# Altium schematic sheet 2015-02-06_16-54-561.schdoc
size 214 x 111 mm; SheetNumber: 1; SheetTotal: 1
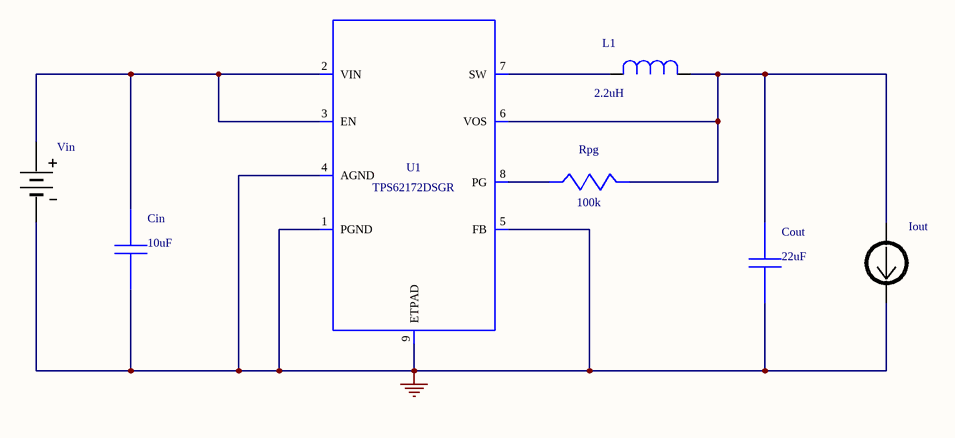
[diagram p0: 2015-02-06_16-54-561.schdoc]

## Parts
Cin  value 10uF  (hidden comment: GRM219R61E106KA12)
Cout  value 22uF  (hidden comment: GRM31CR70J226KE19L)
Iout  WB_CURRENT_LOAD  (value not drawn)
L1  value 2.2uH  (hidden comment: 'VLF252015MT-2R2M')
Rpg  value 100k  (hidden comment: CRCW0402100KFKED)
U1  TPS62172DSGR
Vin  WB_BATTERY  (value not drawn)

## Nets
0: Cin.2 Cout.2 Iout.2(-) U1.1(PGND) U1.4(AGND) U1.5(FB) U1.9(ETPAD) Vin.2(-)
NetCin_1: Cin.1 U1.2(VIN) U1.3(EN) Vin.1(+)
NetCout_1: Cout.1 Iout.1(+) L1.1 Rpg.1 U1.6(VOS)
NetL1_2: L1.2 U1.7(SW)
NetRpg_2: Rpg.2 U1.8(PG)

## Library data of the parts
Cin = GRM219R61E106KA12: GRM219R61E106KA1; Manufacturer Name: MuRata; PackageReference: GRM219R61E106KA12; Manufacturer Part Number: GRM219R61E106KA12
Cout = GRM31CR70J226KE19L: GRM31CR70J226KE1; Manufacturer Name: MuRata; PackageReference: GRM31CR70J226KE19L; Manufacturer Part Number: GRM31CR70J226KE19L
Iout = WB_CURRENT_LOAD: Imported; PowerPortType: POWER_GROUND; Value: Value; Manufacturer_Part_Number: WB_CURRENT_LOAD; Manufacturer_Name: WB_CURRENT_LOAD; RefDes: RefDes; TYPE: TYPE
L1 = 'VLF252015MT-2R2M': VLF252015MT-2R2M; Manufacturer Name: TDK; PackageReference: VLF252015MT-2R2M; Manufacturer Part Number: 'VLF252015MT-2R2M'
Rpg = CRCW0402100KFKED: Manufacturer Name: Vishay-Dale; PackageReference: CRCW0402100KFKED; Manufacturer Part Number: CRCW0402100KFKED
U1 = TPS62172DSGR: Manufacturer Name: Texas Instruments; Value: UNLISTED; PackageReference: TPS62172DSGR; Manufacturer Part Number: TPS62172DSGR
Vin = WB_BATTERY: Imported; PowerPortType: POWER_GROUND; Value: Value; Manufacturer_Part_Number: WB_BATTERY; Manufacturer_Name: WB_BATTERY; RefDes: RefDes; TYPE: TYPE